# Altium schematic sheet LED_Controller_4Channels.SchDoc
size A4
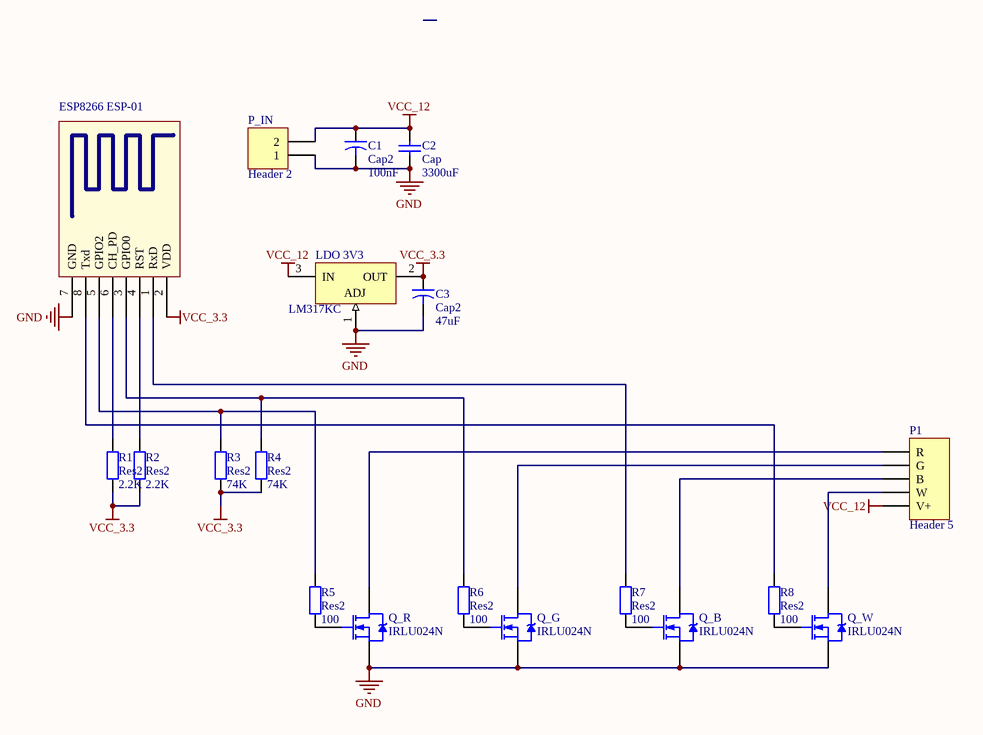
[diagram p0: LED_Controller_4Channels.SchDoc]

## Parts
C1  Cap2  value 100nF  [CAPR5-4X5]
C2  Cap  value 3300uF  [RAD-0.3]
C3  Cap2  value 47uF  [CAPR5-4X5]
IC  ESP8266 ESP-01  [ESP8266 ESP-01]
LDO_3V3  LM317KC  [KC03]
P1  Header 5  [HDR1X5]
P_IN  Header 2  [HDR1X2]
Q_B  IRLU024N  [D-Pack]
Q_G  IRLU024N  [D-Pack]
Q_R  IRLU024N  [D-Pack]
Q_W  IRLU024N  [D-Pack]
R1  Res2  value 2.2K  [AXIAL-0.4]
R2  Res2  value 2.2K  [AXIAL-0.4]
R3  Res2  value 74K  [AXIAL-0.4]
R4  Res2  value 74K  [AXIAL-0.4]
R5  Res2  value 100  [AXIAL-0.4]
R6  Res2  value 100  [AXIAL-0.4]
R7  Res2  value 100  [AXIAL-0.4]
R8  Res2  value 100  [AXIAL-0.4]

## Nets
GND: C1.2 C2.1 C3.2 IC.7(GND) LDO_3V3.1(ADJ) P_IN.1 Q_B.3(S) Q_G.3(S) Q_R.3(S) Q_W.3(S)
VCC_3.3: C3.1 IC.2(VDD) LDO_3V3.2(OUT) R1.1 R2.1 R3.1 R4.1
VCC_12: C1.1 C2.2 LDO_3V3.3(IN) P1.5(V+) P_IN.2
NetIC_1: IC.1(RxD) R7.2
NetIC_3: IC.3(GPIO0) R4.2 R6.2
NetIC_4: IC.4(RST) R2.2
NetIC_5: IC.5(GPIO2) R3.2 R5.2
NetIC_6: IC.6(CH_PD) R1.2
NetIC_8: IC.8(Txd) R8.2
NetP1_1: P1.1(R) Q_R.2(D)
NetP1_2: P1.2(G) Q_G.2(D)
NetP1_3: P1.3(B) Q_B.2(D)
NetP1_4: P1.4(W) Q_W.2(D)
NetQ_B_1: Q_B.1(G) R7.1
NetQ_G_1: Q_G.1(G) R6.1
NetQ_R_1: Q_R.1(G) R5.1
NetQ_W_1: Q_W.1(G) R8.1

## Library data of the parts
C1 C3 = Cap2: Capacitor; Published: 23-Sep-2002; PackageReference: CAPR5-4X5; Publisher: Altium Limited; PackageDescription: Capacitor; 2 Leads
C2 = Cap: Capacitor; Published: 8-Jun-2000; LatestRevisionDate: 17-Jul-2002; LatestRevisionNote: Re-released for DXP Platform.; PackageReference: RAD-0.3; Publisher: Altium Limited; PackageDescription: Radial Cap, Thru-Hole; 2 Leads; 0.3 in Pin Spacing
LDO_3V3 = LM317KC: 3-Terminal Adjustable Regulator; Note: Pin 2 is electrically connected to tab; Published: 15-Apr-2002; DatasheetVersion: Feb-1988; PackageVersion: Sep-1995; PackageReference: KC03; Publisher: Altium Limited; PackageDescription: TO, Thru-Hole, Vertical, Heatsink Mounted; 3 In-Line Leads; Pitch 2.54 mm; ComponentLink1Description: Manufacturer Link; ComponentLink1URL: http://www.ti.com/
P1 = Header 5: Header, 5-Pin; LatestRevisionDate: 17-Jul-2002; LatestRevisionNote: Re-released for DXP Platform.; Publisher: Altium Limited
P_IN = Header 2: Header, 2-Pin; LatestRevisionDate: 17-Jul-2002; LatestRevisionNote: Re-released for DXP Platform.; Publisher: Altium Limited
Q_B Q_G Q_R Q_W = IRLU024N: HEXFET Power MOSFET; Note: Pin 2 is electrically connected to pin 4.; Published: 8-Jun-2000; LatestRevisionDate: 17-Jul-2002; LatestRevisionNote: Re-released for DXP Platform.; PackageReference: TO-251AA; Publisher: Altium Limited; PackageDescription: TO, Thru-Hole, Vertical, Heatsink Mounted; 3 In-Line Leads; Pitch 2.28 mm; ComponentLink1Description: Manufacturer Link; ComponentLink1URL: http://www.irf.com/; ComponentLink2Description: Datasheet; ComponentLink2URL: http://www.irf.com/product-info/datasheets/data/irlr024n.pdf
R1-R8 = Res2: Resistor; Published: 8-Jun-2000; LatestRevisionDate: 17-Jul-2002; LatestRevisionNote: Re-released for DXP Platform.; PackageReference: AXIAL-0.4; Publisher: Altium Limited; PackageDescription: Axial Device, Thru-Hole; 2 Leads; 0.4 in Pin Spacing